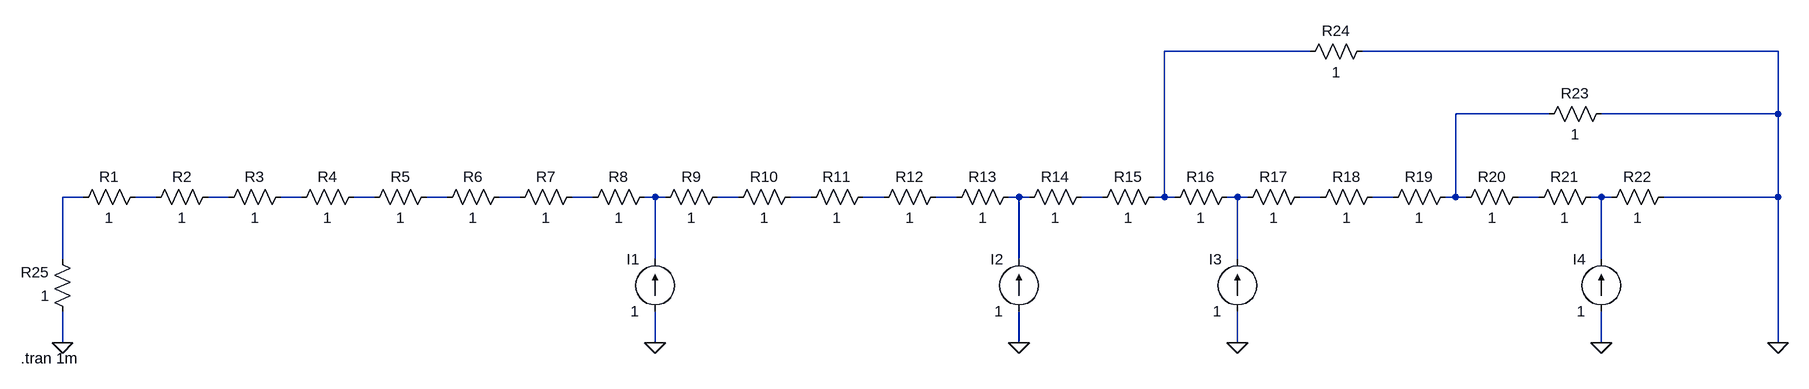
[diagram p0: schematic Equivalent_ThermalCircuit.asc]
Equivalent_ThermalCircuit.asc, the LTspice schematic file:
Version 4
SHEET 1 2644 680
WIRE 1904 -16 1680 -16
WIRE 2624 -16 1984 -16
WIRE 2272 80 2128 80
WIRE 2624 80 2624 -16
WIRE 2624 80 2352 80
WIRE 16 208 -16 208
WIRE 128 208 96 208
WIRE 240 208 208 208
WIRE 352 208 320 208
WIRE 464 208 432 208
WIRE 576 208 544 208
WIRE 688 208 656 208
WIRE 800 208 768 208
WIRE 896 208 880 208
WIRE 912 208 896 208
WIRE 1024 208 992 208
WIRE 1136 208 1104 208
WIRE 1248 208 1216 208
WIRE 1360 208 1328 208
WIRE 1456 208 1440 208
WIRE 1472 208 1456 208
WIRE 1584 208 1552 208
WIRE 1680 208 1680 -16
WIRE 1680 208 1664 208
WIRE 1696 208 1680 208
WIRE 1792 208 1776 208
WIRE 1808 208 1792 208
WIRE 1920 208 1888 208
WIRE 2032 208 2000 208
WIRE 2128 208 2128 80
WIRE 2128 208 2112 208
WIRE 2144 208 2128 208
WIRE 2256 208 2224 208
WIRE 2352 208 2336 208
WIRE 2368 208 2352 208
WIRE 2624 208 2624 80
WIRE 2624 208 2448 208
WIRE -16 304 -16 208
WIRE 896 304 896 208
WIRE 1456 304 1456 208
WIRE 1792 304 1792 208
WIRE 2352 304 2352 208
WIRE -16 432 -16 384
WIRE 896 432 896 384
WIRE 1456 432 1456 384
WIRE 1792 432 1792 384
WIRE 2352 432 2352 384
WIRE 2624 432 2624 208
FLAG -16 432 0
FLAG 2624 432 0
FLAG 2352 432 0
FLAG 1792 432 0
FLAG 1456 432 0
FLAG 896 432 0
SYMBOL res 112 192 R90
WINDOW 0 0 56 VBottom 2
WINDOW 3 32 56 VTop 2
SYMATTR InstName R1
SYMATTR Value 1
SYMBOL res 224 192 R90
WINDOW 0 0 56 VBottom 2
WINDOW 3 32 56 VTop 2
SYMATTR InstName R2
SYMATTR Value 1
SYMBOL res 336 192 R90
WINDOW 0 0 56 VBottom 2
WINDOW 3 32 56 VTop 2
SYMATTR InstName R3
SYMATTR Value 1
SYMBOL res 448 192 R90
WINDOW 0 0 56 VBottom 2
WINDOW 3 32 56 VTop 2
SYMATTR InstName R4
SYMATTR Value 1
SYMBOL res 560 192 R90
WINDOW 0 0 56 VBottom 2
WINDOW 3 32 56 VTop 2
SYMATTR InstName R5
SYMATTR Value 1
SYMBOL res 672 192 R90
WINDOW 0 0 56 VBottom 2
WINDOW 3 32 56 VTop 2
SYMATTR InstName R6
SYMATTR Value 1
SYMBOL res 784 192 R90
WINDOW 0 0 56 VBottom 2
WINDOW 3 32 56 VTop 2
SYMATTR InstName R7
SYMATTR Value 1
SYMBOL res 896 192 R90
WINDOW 0 0 56 VBottom 2
WINDOW 3 32 56 VTop 2
SYMATTR InstName R8
SYMATTR Value 1
SYMBOL res 1008 192 R90
WINDOW 0 0 56 VBottom 2
WINDOW 3 32 56 VTop 2
SYMATTR InstName R9
SYMATTR Value 1
SYMBOL res 1120 192 R90
WINDOW 0 0 56 VBottom 2
WINDOW 3 32 56 VTop 2
SYMATTR InstName R10
SYMATTR Value 1
SYMBOL res 1232 192 R90
WINDOW 0 0 56 VBottom 2
WINDOW 3 32 56 VTop 2
SYMATTR InstName R11
SYMATTR Value 1
SYMBOL res 1344 192 R90
WINDOW 0 0 56 VBottom 2
WINDOW 3 32 56 VTop 2
SYMATTR InstName R12
SYMATTR Value 1
SYMBOL res 1456 192 R90
WINDOW 0 0 56 VBottom 2
WINDOW 3 32 56 VTop 2
SYMATTR InstName R13
SYMATTR Value 1
SYMBOL res 1568 192 R90
WINDOW 0 0 56 VBottom 2
WINDOW 3 32 56 VTop 2
SYMATTR InstName R14
SYMATTR Value 1
SYMBOL res 1680 192 R90
WINDOW 0 0 56 VBottom 2
WINDOW 3 32 56 VTop 2
SYMATTR InstName R15
SYMATTR Value 1
SYMBOL res 1792 192 R90
WINDOW 0 0 56 VBottom 2
WINDOW 3 32 56 VTop 2
SYMATTR InstName R16
SYMATTR Value 1
SYMBOL res 1904 192 R90
WINDOW 0 0 56 VBottom 2
WINDOW 3 32 56 VTop 2
SYMATTR InstName R17
SYMATTR Value 1
SYMBOL res 2016 192 R90
WINDOW 0 0 56 VBottom 2
WINDOW 3 32 56 VTop 2
SYMATTR InstName R18
SYMATTR Value 1
SYMBOL res 2128 192 R90
WINDOW 0 0 56 VBottom 2
WINDOW 3 32 56 VTop 2
SYMATTR InstName R19
SYMATTR Value 1
SYMBOL res 2240 192 R90
WINDOW 0 0 56 VBottom 2
WINDOW 3 32 56 VTop 2
SYMATTR InstName R20
SYMATTR Value 1
SYMBOL res 2352 192 R90
WINDOW 0 0 56 VBottom 2
WINDOW 3 32 56 VTop 2
SYMATTR InstName R21
SYMATTR Value 1
SYMBOL res 2464 192 R90
WINDOW 0 0 56 VBottom 2
WINDOW 3 32 56 VTop 2
SYMATTR InstName R22
SYMATTR Value 1
SYMBOL res 2368 64 R90
WINDOW 0 0 56 VBottom 2
WINDOW 3 32 56 VTop 2
SYMATTR InstName R23
SYMATTR Value 1
SYMBOL res 2000 -32 R90
WINDOW 0 0 56 VBottom 2
WINDOW 3 32 56 VTop 2
SYMATTR InstName R24
SYMATTR Value 1
SYMBOL res 0 400 R180
WINDOW 0 36 76 Left 2
WINDOW 3 36 40 Left 2
SYMATTR InstName R25
SYMATTR Value 1
SYMBOL current 896 384 R180
WINDOW 0 24 80 Left 2
WINDOW 3 24 0 Left 2
WINDOW 123 0 0 Left 0
WINDOW 39 0 0 Left 0
SYMATTR InstName I1
SYMATTR Value 1
SYMBOL current 1456 384 R180
WINDOW 0 24 80 Left 2
WINDOW 3 24 0 Left 2
WINDOW 123 0 0 Left 0
WINDOW 39 0 0 Left 0
SYMATTR InstName I2
SYMATTR Value 1
SYMBOL current 1792 384 R180
WINDOW 0 24 80 Left 2
WINDOW 3 24 0 Left 2
WINDOW 123 0 0 Left 0
WINDOW 39 0 0 Left 0
SYMATTR InstName I3
SYMATTR Value 1
SYMBOL current 2352 384 R180
WINDOW 0 24 80 Left 2
WINDOW 3 24 0 Left 2
WINDOW 123 0 0 Left 0
WINDOW 39 0 0 Left 0
SYMATTR InstName I4
SYMATTR Value 1
TEXT -80 456 Left 2 !.tran 1m

The netlist it stands for:
* Equivalent_ThermalCircuit.asc
R1 N004 N003 1
R2 N005 N004 1
R3 N006 N005 1
R4 N007 N006 1
R5 N008 N007 1
R6 N009 N008 1
R7 N010 N009 1
R8 N011 N010 1
R9 N012 N011 1
R10 N013 N012 1
R11 N014 N013 1
R12 N015 N014 1
R13 N016 N015 1
R14 N017 N016 1
R15 N001 N017 1
R16 N018 N001 1
R17 N019 N018 1
R18 N020 N019 1
R19 N002 N020 1
R20 N021 N002 1
R21 N022 N021 1
R22 0 N022 1
R23 0 N002 1
R24 0 N001 1
R25 0 N003 1
I1 0 N011 1
I2 0 N016 1
I3 0 N018 1
I4 0 N022 1
.tran 1m
.backanno
.end